# EAGLE design datalogger_micro (EAGLE 7.3.0)
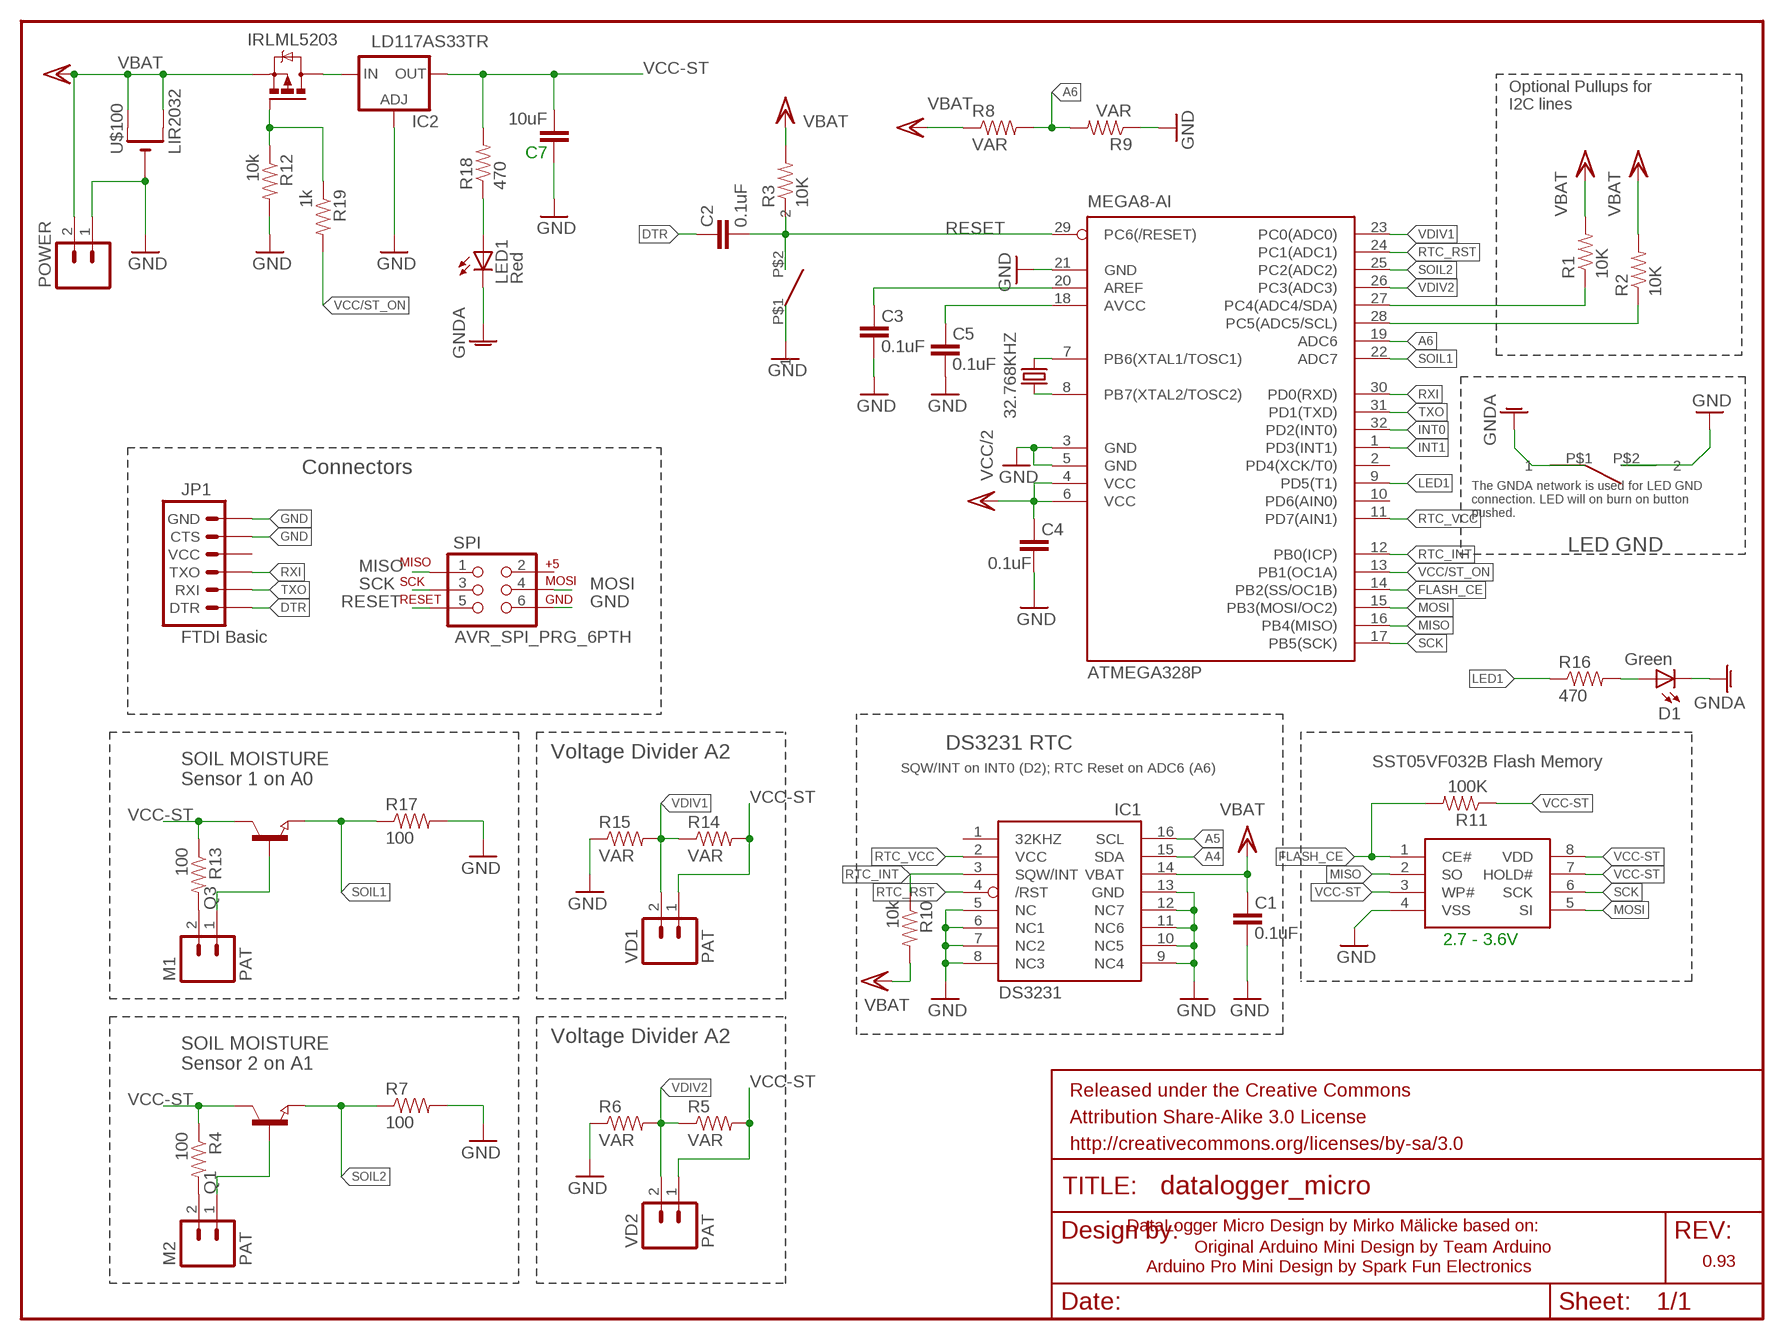
[diagram p0: schematic, sheet 1]

## Parts
32.768KHZ  CRYSTALTC38H  [TC38H]
ATMEGA328P  MEGA8-AI  [TQFP32-08]
C1  0.1uF  CAP0603-CAP  [0603-CAP]
C2  0.1uF  CAP0603-CAP  [0603-CAP]
C3  0.1uF  CAP0603-CAP  [0603-CAP]
C4  0.1uF  CAP0603-CAP  [0603-CAP]
C5  0.1uF  CAP0603-CAP  [0603-CAP]
C7  10uF  CAP1206  [1206]
D1  Green  LED  [0603-LED-ALT1]
FRAME1  FRAME-LETTER  [CREATIVE_COMMONS]
IC1  DS3231/SO  [SO16W]
IC2  LD117AS33TR  [SOT223]
JP1  FTDI Basic  ARDUINO_SERIAL_PROGRAMPTH  [1X06]
LED1  Red  LED  [0603-LED-ALT1]
M1  PAT  M02PTH  [1X02]
M2  PAT  M02PTH  [1X02]
POWER  M02PTH  [1X02]
Q1  NPN-TRANSISTOR_SOT23  [SOT23]
Q2  IRLML5203  [MICRO3]
Q3  NPN-TRANSISTOR_SOT23  [SOT23]
R1  10K  RESISTOR0603-RES  [0603-RES]
R2  10K  RESISTOR0603-RES  [0603-RES]
R3  10K  RESISTOR0603-RES  [0603-RES]
R4  100  RESISTOR0603-RES  [0603-RES]
R5  VAR  RESISTOR0603-RES  [0603-RES]
R6  VAR  RESISTOR0603-RES  [0603-RES]
R7  100  RESISTOR0603-RES  [0603-RES]
R8  VAR  RESISTOR0603-RES  [0603-RES]
R9  VAR  RESISTOR0603-RES  [0603-RES]
R10  10k  RESISTOR0603-RES  [0603-RES]
R11  100K  RESISTOR0603-RES  [0603-RES]
R12  10k  RESISTOR0603-RES  [0603-RES]
R13  100  RESISTOR0603-RES  [0603-RES]
R14  VAR  RESISTOR0603-RES  [0603-RES]
R15  VAR  RESISTOR0603-RES  [0603-RES]
R16  470  RESISTOR0603-RES  [0603-RES]
R17  100  RESISTOR0603-RES  [0603-RES]
R18  470  RESISTOR0603-RES  [0603-RES]
R19  1k  RESISTOR0603-RES  [0603-RES]
SPI  AVR_SPI_PRG_6PTH  [2X3]
U$1  DRUCKTASTER-1PIN  [DRUCKTASTER-1PIN]
U$2  DRUCKTASTER-1PIN  [DRUCKTASTER-1PIN]
U$3  SST25VF032B  [SO-08]
U$100  LIR2032  CR2032SMT  [CR2032-SMD]
VD1  PAT  M02PTH  [1X02]
VD2  PAT  M02PTH  [1X02]

## Nets
A4: ATMEGA328P.27(PC4(ADC4/SDA)) IC1.15(SDA) R1.1
A5: ATMEGA328P.28(PC5(ADC5/SCL)) IC1.16(SCL) R2.1
A6: ATMEGA328P.19(ADC6) R8.2 R9.2
DTR: C2.2 JP1.1(DTR)
FLASH_CE: ATMEGA328P.14(PB2(SS/OC1B)) R11.2 U$3.1(CE#)
GND [vcc]: ATMEGA328P.3(GND) ATMEGA328P.5(GND) ATMEGA328P.21(GND) C1.1 C3.1 C4.1 C5.1 C7.2 IC1.5(NC) IC1.6(NC1) IC1.7(NC2) IC1.8(NC3) IC1.9(NC4) IC1.10(NC5) IC1.11(NC6) IC1.12(NC7) IC1.13(GND) IC2.1(ADJ) JP1.5(CTS) JP1.6(GND) POWER.1 R6.1 R7.2 R9.1 R12.2 R15.1 R17.2 SPI.6 U$1.P$1 U$2.P$2 U$3.4(VSS) U$100.-
GNDA: D1.C LED1.C U$2.P$1
INT0: ATMEGA328P.32(PD2(INT0))
INT1: ATMEGA328P.1(PD3(INT1))
LED1: ATMEGA328P.9(PD5(T1)) R16.1
MISO: ATMEGA328P.16(PB4(MISO)) SPI.1 U$3.2(SO)
MOSI: ATMEGA328P.15(PB3(MOSI/OC2)) SPI.4 U$3.5(SI)
N$1: ATMEGA328P.20(AREF) C3.2
N$2: 32.768KHZ.1 ATMEGA328P.7(PB6(XTAL1/TOSC1))
N$3: 32.768KHZ.2 ATMEGA328P.8(PB7(XTAL2/TOSC2))
N$4: LED1.A R18.1
N$5: M2.1 Q1.1(B)
N$6: M1.1 Q3.1(B)
N$7: D1.A R16.2
N$8: M2.2 R4.2
N$9: M1.2 R13.2
N$10: IC2.3(IN) Q2.3(D)
N$11: Q2.1(G) R12.1 R19.1
RESET: ATMEGA328P.29(PC6(/RESET)) C2.1 R3.1 SPI.5 U$1.P$2
RTC_INT: ATMEGA328P.12(PB0(ICP)) IC1.3(SQW/INT) R10.1
RTC_RST: ATMEGA328P.24(PC1(ADC1)) IC1.4(/RST)
RTC_VCC: ATMEGA328P.11(PD7(AIN1)) IC1.2(VCC)
RXI: ATMEGA328P.30(PD0(RXD)) JP1.3(TXO)
SCK: ATMEGA328P.17(PB5(SCK)) SPI.3 U$3.6(SCK)
SOIL1: ATMEGA328P.22(ADC7) Q3.2(E) R17.1
SOIL2: ATMEGA328P.25(PC2(ADC2)) Q1.2(E) R7.1
TXO: ATMEGA328P.31(PD1(TXD)) JP1.2(RXI)
VBAT: ATMEGA328P.4(VCC) ATMEGA328P.6(VCC) ATMEGA328P.18(AVCC) C1.2 C4.2 C5.2 IC1.14(VBAT) POWER.2 Q2.2(S) R1.2 R2.2 R3.2 R8.1 R10.2 U$100.+$1(+) U$100.+$2(+1) ; supply symbol labelled VCC/2
VCC-ST: C7.1 IC2.2(OUT) Q1.3(C) Q3.3(C) R4.1 R5.2 R11.1 R13.1 R14.2 R18.2 U$3.3(WP#) U$3.7(HOLD#) U$3.8(VDD) VD1.1 VD2.1
VCC/ST_ON: ATMEGA328P.13(PB1(OC1A)) R19.2
VDIV1: ATMEGA328P.23(PC0(ADC0)) R14.1 R15.2 VD1.2
VDIV2: ATMEGA328P.26(PC3(ADC3)) R5.1 R6.2 VD2.2
Unconnected: ATMEGA328P.2(PD4(XCK/T0)) ATMEGA328P.10(PD6(AIN0)) IC1.1(32KHZ) JP1.4(VCC) SPI.2

## Notes on the sheet
- Optional Pullups for 
  I2C lines
- Connectors
- The GNDA network is used for LED GND 
  connection. LED will on burn on button
  pushed.
- LED GND
- DS3231 RTC
- Voltage Divider A2
- SST05VF032B Flash Memory
- SQW/INT on INT0 (D2); RTC Reset on ADC6 (A6)
- SOIL MOISTURE
  Sensor 1 on A0
- 2.7 - 3.6V
- Voltage Divider A2
- SOIL MOISTURE
  Sensor 2 on A1
- DataLogger Micro Design by Mirko Mälicke based on:
- Original Arduino Mini Design by Team Arduino
- 0.93
- Arduino Pro Mini Design by Spark Fun Electronics

## Library data of the parts
32.768KHZ = crystal:CRYSTAL: CRYSTAL; OC_FARNELL: unknown; OC_NEWARK: unknown
ATMEGA328P = atmel:MEGA8: MICROCONTROLLER 8 Kbytes FLASH, 1 kbytes SRAM, 512 bytes EEPROM, USART, 6-channel 10 bit ADC, 2-channel 8 bit ADC Pin compatible with Atmega48, ATMega88, ATMega168 Source: avr.lbr; MPN: ATMEGA8-16AU; OC_FARNELL: 9171371; OC_NEWARK: 73M8863
C1-C5 C7 = SparkFun:CAP: Capacitor Standard 0603 ceramic capacitor, and 0.1" leaded capacitor.
D1 LED1 = Testing:LED: LEDs Standard schematic elements and footprints for 5mm, 3mm, 1206, and 0603 sized LEDs. 5mm - Spark Fun Electronics SKU : COM-00529 (and others)
FRAME1 = SparkFun-Aesthetics:FRAME-LETTER: Schematic Frame Standard 8.5x11 US Letter frame
IC1 = adafruit:DS3231
IC2 = v-reg:LD117A?*: Low drop fixed and adjustable positive voltage regulators 1 A Source: http://www.st.com/stonline/products/literature/ds/7194/ld1117axx.pdf
JP1 = SparkFun:ARDUINO_SERIAL_PROGRAM
M1 M2 POWER VD1 VD2 = SparkFun:M02: Header 2 Standard 2-pin 0.1" header. Use with straight break away headers (SKU : PRT-00116), right angle break away headers (PRT-00553), swiss pins (PRT-00743), machine pins (PRT-00117), and female headers (PRT-00115). Molex polarized connector foot print use with SKU : PRT-08233 with associated crimp pins and housings.
Q1 Q3 = semicon-smd-ipc:NPN-TRANSISTOR_: NPN TRANSISTOR
Q2 = transistor-power:IRLML5203: HEXFET P-Channel Power MOSFET
R1-R19 = SparkFun:RESISTOR: Resistor Basic schematic elements and footprints for 0603, 1206, and PTH resistors.
SPI = SparkFun-Connectors:AVR_SPI_PRG_6: AVR ISP 6 Pin This is the reduced ISP connector for AVR programming. Common on Arduino. This footprint will take up less PCB space and can be used with a 10-pin to 6-pin adapter such as SKU: BOB-08508 **Special note about "TEST_POINT" package. The stop mask is on the top side, so if you want your programming test points to be on the bottom of your board, make sure to place this package on the bottom side of the board. This also ensure that the orientation to program from the bottom side will be correct.
U$1 U$2 = Edu Logger Basic Components:DRUCKTASTER-1PIN: Drucktaster (1x EIN) Einfacher schmaler Drucktaster als DIP Variante (1x 2pin) Dimension (B x L x H): 3.5mm x 6mm x 5mm Zu kaufen u.a. beim Omega, Freiburg
U$3 = SST25:SST25VF032B
U$100 = adafruit:CR2032

## Net classes
1 vcc: width 0.254 mm

## Board
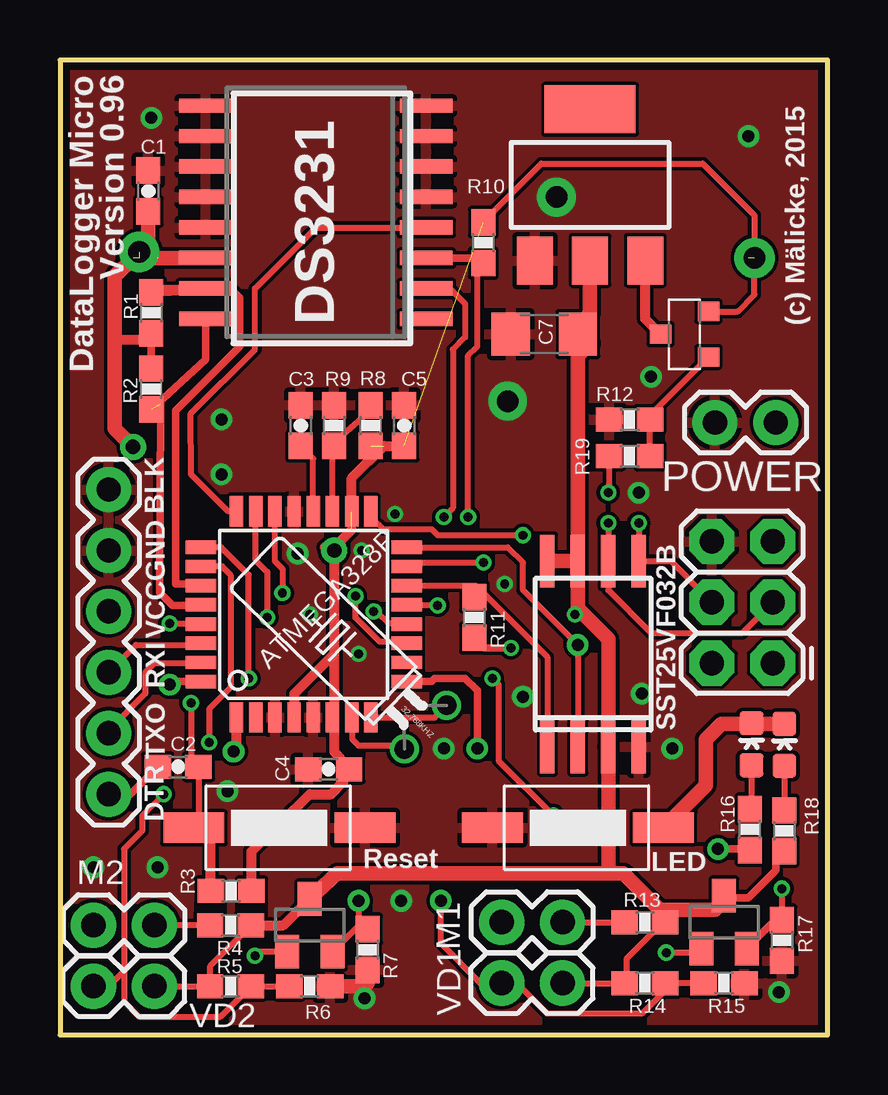
[diagram p1: board, top side]
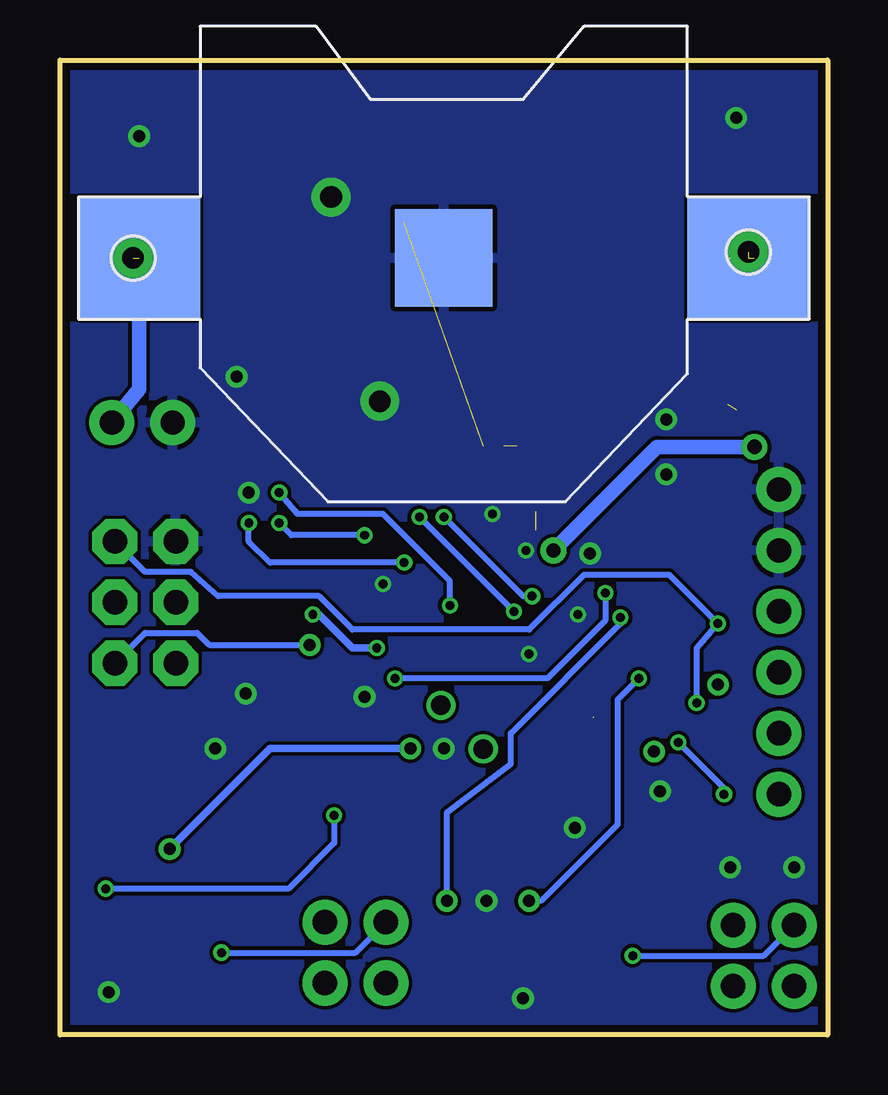
[diagram p2: board, bottom side, seen from below]

Size 32 x 40.64 mm. Coordinates in mm from the lower left corner, seen from the top.
Outline: 0,40.64 0,0 32,0 32,40.64 0,40.64
Copper layers (1*16): Top 0.035mm / dielectric 1.5mm / Bottom 0.035mm
Design rules "PCB-POOL Standard *": minimum track width 0.15mm, minimum drill 0.2mm, track to track 0.15mm, track to pad 0.15mm, pad to pad 0.15mm, via to via 0.15mm, smd to smd 0.15mm, copper to edge 0.3mm, drill to drill 0.2mm, minimum pad ring 0.2mm, minimum via ring 0.15mm, stop-mask expansion 0.075mm, vias tented up to drill 0mil, thermal gap 0.2mm

### Footprints (pad centres in the part's own frame; a part is rotated, then mirrored left to right if it is on the bottom)
TC38H = drill 0.813: 1 -1.27,0; 2 1.27,0
TQFP32-08 = smd 1.27 x 0.559: 1 -4.293,2.8; 2 -4.293,2; 3 -4.293,1.2; 4 -4.293,0.4; 5 -4.293,-0.4; 6 -4.293,-1.2; 7 -4.293,-2; 8 -4.293,-2.8; 17 4.293,-2.8; 18 4.293,-2; 19 4.293,-1.2; 20 4.293,-0.4; 21 4.293,0.4; 22 4.293,1.2; 23 4.293,2; 24 4.293,2.8 | smd 0.559 x 1.27: 9 -2.8,-4.293; 10 -2,-4.293; 11 -1.2,-4.293; 12 -0.4,-4.293; 13 0.4,-4.293; 14 1.2,-4.293; 15 2,-4.293; 16 2.8,-4.293; 25 2.8,4.293; 26 2,4.293; 27 1.2,4.293; 28 0.4,4.293; 29 -0.4,4.293; 30 -1.2,4.293; 31 -2,4.293; 32 -2.8,4.293
0603-CAP = smd 1.1 x 1: 1 -0.85,0; 2 0.85,0
1206 = smd 1.6 x 1.8: 1 -1.4,0; 2 1.4,0
0603-LED-ALT1 = smd 1 x 1: A 0,-0.877; C 0,0.877
SO16W = smd 0.6 x 2.2: 1 -4.445,-4.6; 2 -3.175,-4.6; 3 -1.905,-4.6; 4 -0.635,-4.6; 5 0.635,-4.6; 6 1.905,-4.6; 7 3.175,-4.6; 8 4.445,-4.6; 9 4.445,4.6; 10 3.175,4.6; 11 1.905,4.6; 12 0.635,4.6; 13 -0.635,4.6; 14 -1.905,4.6; 15 -3.175,4.6; 16 -4.445,4.6
SOT223 = smd 1.5 x 2: 1 -2.3,-3.15; 2 0,-3.15; 3 2.3,-3.15 | smd 3.8 x 2: 4 0,3.15
1X06 = drill 1.016 pad 1.88: 1 0,0; 2 2.54,0; 3 5.08,0; 4 7.62,0; 5 10.16,0; 6 12.7,0
1X02 = drill 1.016 pad 1.88: 1 0,0; 2 2.54,0
SOT23 = smd 1 x 1.4: 1 -0.95,-1.1; 2 0.95,-1.1; 3 0,1.1
MICRO3 = smd 0.8 x 0.9: 1 -0.95,-1; 2 0.95,-1; 3 0,1
0603-RES = smd 1.1 x 1: 1 -0.85,0; 2 0.85,0
2X3 = drill 1.016 pad 1.88 octagon: 1 0,0; 2 0,2.54; 3 2.54,0; 4 2.54,2.54; 5 5.08,0; 6 5.08,2.54
DRUCKTASTER-1PIN = smd 2.54 x 1.27: P$1 -3.575,0; P$2 3.56,0
SO-08 = smd 0.6 x 2.2: 1 -1.905,-3.87; 2 -0.635,-3.87; 3 0.635,-3.87; 4 1.905,-3.87; 5 1.905,3.87; 6 0.635,3.87; 7 -0.635,3.87; 8 -1.905,3.87
CR2032-SMD = smd 5.08 x 5.08: +$1 -12.7,0; +$2 12.7,0 | smd 4.064 x 4.064: - 0,0

### Placement (x,y rotation side)
32.768KHZ  15.24,12.83 46 top
ATMEGA328P  10.16,17.53 90 top
C1  3.68,35.18 270 top
C2  4.93,11.18 180 top
C3  10.03,25.4 270 top
C4  11.2,11.07 0 top
C5  14.35,25.4 270 top
C7  20.19,29.21 180 top
D1  28.83,12.12 0 top
FRAME1  -20.94,-10.79 0 top  (outside the outline)
IC1  10.67,34.29 90 top
IC2  22.1,35.43 0 top
JP1  2.03,10.03 90 top
LED1  30.2,12.09 0 top
M1  18.41,4.7 0 top
M2  1.4,4.57 0 top
POWER  27.31,25.53 0 top
Q1  10.41,4.57 0 top
Q2  26.04,29.21 90 top
Q3  27.69,4.7 0 top
R1  3.81,30.1 270 top
R2  3.81,26.92 90 top
R3  7.14,5.99 0 top
R4  7.11,4.57 180 top
R5  7.11,2.03 180 top
R6  10.41,2.03 180 top
R7  12.83,3.56 270 top
R8  12.95,25.4 90 top
R9  11.43,25.4 270 top
R10  17.65,33.02 90 top
R11  17.27,17.4 90 top
R12  23.75,25.65 180 top
R13  24.38,4.7 180 top
R14  24.38,2.16 180 top
R15  27.69,2.16 180 top
R16  28.76,8.56 90 top
R17  30.1,3.94 270 top
R18  30.2,8.51 270 top
R19  23.75,24.13 180 top
SPI  29.72,15.49 90 top
U$1  9.14,8.64 180 top
U$2  21.59,8.64 180 top
U$3  22.23,15.88 0 top
U$100  16,32.38 0 bottom
VD1  20.96,2.16 180 top
VD2  3.94,2.03 180 top

### Tracks (layer width: path | path; a pad name or v marks a point on that pad's centre or on a via)
A4
  Top 0.305: IC1.15 4.18,31.12 R1.1 7.2,31.02 7.49,30.73 7.49,28.7 4.83,26.04 4.83,18.8 5.8,18.8 ATMEGA328P.27
A5  (1 unrouted)
  Top 0.305: 4.19,26.29 4.17,18.44 4.7,17.91 5.85,17.91 ATMEGA328P.28 | IC1.16 6.07,28.15 R2.1
A6
  Top 0.254: ATMEGA328P.19 11.36,24.42 R9.2 11.76,24.42 11.81,24.47 11.81,25.02 12.95,26.04 R8.2
DTR
  Top 0.305: JP1.1 2.92,10.03 C2.2
FLASH_CE
  Top 0.254: ATMEGA328P.14 17.34,18.73 17.59,18.48 | 17.59,18.48 20.32,15.75 U$3.1 | R11.2 17.53,18.41 17.59,18.48
GND  (via drill 0.37 pad 0.25, 0.5 pad 0.25, 0.9 pad 0.25)
  Top 0.254: 10.54,13.25 ATMEGA328P.5
  Top 0.61: R6.1 12.7,2.03 12.83,2.16 R7.2
  other vias: 24.64,27.43 1.4,6.99 19.3,14.1 18.67,26.42 3.81,38.23 6.99,10.16 14.22,5.59 4.06,6.99 10.54,8.64 25.53,11.94 16,11.94 12.7,1.52 29.97,1.78 28.7,37.46 24.13,22.61 9.91,20.07 24.26,14.22 20.7,34.92 18.54,18.8 10.41,17.53 12.45,15.88 12.57,20.19 13.97,21.72 6.73,23.37 6.73,25.65
  pour Bottom: -0.38,41.78 33.02,41.78 33.02,-1.14 -0.38,-1.02
  pour Top: -0.38,-1.02 33.02,-1.14 33.02,41.78 -0.38,41.78
GNDA
  Top 0.61: D1.C LED1.C 27.57,12.97 26.92,12.32 26.92,10.4 U$2.P$1
INT0  (via drill 0.5)
  Top 0.305: v4.57,14.61 4.95,14.73 5.75,14.73 ATMEGA328P.32
INT1  (via drill 0.5)
  Top 0.406: v7.24,11.81 7.36,11.93 ATMEGA328P.1
LED1  (via drill 0.5)
  Top 0.305: ATMEGA328P.9 15.49,14.73 15.62,14.86 16.89,14.86 17.4,14.35 v17.4,11.94 | v27.43,7.75 28.73,7.75 R16.1
  Bottom 0.305: v17.4,11.94 23.24,11.94 v27.43,7.75
MISO  (via drill 0.5)
  Top 0.254: ATMEGA328P.16 18.66,20.33 19.3,19.68 19.3,18.54 21.4,16.45 v21.59,16.26 U$3.2
  Bottom 0.254: SPI.1 28.45,16.76 26.29,16.76 25.78,16.26 v21.59,16.26
MOSI  (via drill 0.37)
  Top 0.254: ATMEGA328P.15 14.95,19.53 15.11,19.68 v17.65,19.68 | v24.13,21.34 U$3.5 25.47,19.74 SPI.4
  Bottom 0.254: v17.65,19.68 23.24,19.68 24.13,20.57 v24.13,21.34
N$1
  Top 0.254: ATMEGA328P.20 10.56,24.02 C3.2
N$2
  Top 0.254: ATMEGA328P.7 12.16,12.73 12.19,12.7 12.19,12.32 12.45,12.07 14.33,12.07 32.768KHZ.1
N$3
  Top 0.254: ATMEGA328P.8 15.62,13.23 32.768KHZ.2
N$4
  Top 0.254: LED1.A 30.2,9.49 R18.1
N$5  (via drill 0.37)
  Top 0.254: Q1.1 8.3,3.47 v8.13,3.3
  Bottom 0.254: v8.13,3.3 2.67,3.3 M2.1
N$6  (via drill 0.37)
  Top 0.254: Q3.1 26.54,3.43 v25.27,3.43
  Bottom 0.254: v25.27,3.43 19.69,3.43 M1.1
N$7
  Top 0.254: D1.A 28.83,9.85 R16.2
N$8
  Top 0.254: R4.2 M2.2
N$9
  Top 0.254: M1.2 R13.2
N$10
  Top 0.406: Q2.3 24.4,29.85 IC2.3
  Top 0.61: 24.77,32.54 IC2.3
N$11
  Top 0.254: R19.1 R12.1 24.6,25.82 Q2.1
RESET  (via drill 0.37)
  Top 0.254: v4.57,17.14 5.5,17.14 ATMEGA328P.29 | 5.84,8.51 5.08,8.51 U$1.P$2 5.78,8.83 C2.1 5.71,11.56 5.46,11.56 v5.46,13.84
  Top 0.406: R3.1 6.29,8.06 U$1.P$2
  Bottom 0.254: v5.46,13.84 5.46,16.13 v4.57,17.14 6.6,19.18 10.16,19.18 12.45,16.89 19.81,16.89 21.21,18.29 25.4,18.29 26.54,19.3 28.45,19.3 SPI.5
RTC_INT  (via drill 0.37)
  Top 0.254: ATMEGA328P.12 14.43,17.14 13.72,17.14 13.21,17.65 v13.08,17.65 | v17.02,21.59 17.02,28.32 17.4,28.7 17.4,31.88 17.65,32.13 R10.1
  Top 0.305: IC1.3 17.57,32.38 R10.1
  Bottom 0.254: v13.08,17.65 v17.02,21.59
RTC_RST
  Top 0.254: ATMEGA328P.24 7.01,21.82 5.46,23.37 5.45,25.9 8.13,28.57 8.13,31.12 10.67,33.66 IC1.4
RTC_VCC  (via drill 0.37)
  Top 0.254: ATMEGA328P.11 14.4,16.38 13.34,16.38 12.32,17.4 v12.32,18.29 | IC1.2 16.26,31.12 16.89,30.48 16.89,29.08 16.38,28.57 16.38,21.97 v16,21.59
  Bottom 0.254: v12.32,18.29 12.7,18.29 v16,21.59
RXI
  Top 0.254: JP1.3 3.17,16.26 5.8,16.26
  Top 0.305: 5.8,16.26 ATMEGA328P.30
SCK  (via drill 0.37)
  Top 0.254: ATMEGA328P.17 13.06,21.56 13.06,21.49 13.46,21.08 15.49,21.08 15.75,20.83 v19.3,20.83 | v22.86,21.34 U$3.6 22.86,18.54 24.64,16.76 28.45,16.76 SPI.3
  Bottom 0.254: v19.3,20.83 22.35,20.83 v22.86,21.34
SOIL1  (via drill 0.37)
  Top 0.254: v18.03,14.86 18.29,14.61 18.29,11.43 v20.57,9.14 | v30.1,6.1 R17.1 | v9.27,18.41 9.27,19.43 8.96,19.74 ATMEGA328P.22
  Top 0.305: Q3.2 29.82,4.79 R17.1
  Bottom 0.254: v9.27,18.41 9.27,17.27 11.68,14.86 v18.03,14.86 | v20.57,9.14 20.57,8 22.48,6.1 v30.1,6.1
SOIL2  (via drill 0.37, 0.5)
  Top 0.254: v12.45,5.59 12.45,4.55 | v7.87,14.86 7.87,19.18 6.73,20.33 ATMEGA328P.25 | Q1.2 12.45,4.55 | 12.45,4.55 12.83,4.55 R7.1
  Bottom 0.254: v7.87,14.86 8.76,13.97 8.76,8.76 11.94,5.59 v12.45,5.59
TXO
  Top 0.254: 5.83,15.49 3.94,15.49 3.56,15.11 3.56,14.22 2.03,12.7 JP1.2
  Top 0.305: 5.83,15.49 ATMEGA328P.31
VBAT  (via drill 0.6, 0.9 pad 1.68)  (8 unrouted)
  Top 0.254: 17.65,33.91 20.07,36.32 26.8,36.32 28.96,34.16 v28.96,32.38 28.96,30.86 28.25,30.16 Q2.2
  Top 0.305: R2.2 R1.2
  Top 0.406: 11.3,13.18 ATMEGA328P.6 | 12.16,21.05 11.43,20.32 | 11.43,20.32 v11.43,20.19 11.43,15.88 | 11.43,15.88 11.43,13.3 ATMEGA328P.6 | 9.78,13.21 9.78,14.22 11.43,15.88 | ATMEGA328P.6 11.43,12.91 11.43,11.81 C4.2 11.81,10.54 11.3,10.03 10.41,10.03 7.99,7.65 R3.2 | R1.2 3.72,28.96 2.29,28.96 | 11.05,20.32 11.43,20.32 | ATMEGA328P.18 12.16,23.21 13.5,24.55 C5.2
  Top 0.61: IC1.14 4.1,32.38 | 4.02,32.38 3.05,32.38 2.29,31.62 2.29,28.96 2.29,25.27 v3.05,24.51 | R10.2 17.65,33.91 | C1.2 3.68,32.64 v3.3,32.64
  Bottom 0.61: POWER.2 28.7,26.92 U$100.+$1 | v11.43,20.19 7.11,24.51 v3.05,24.51
VCC-ST  (via drill 0.37)
  Top 0.254: VD2.1 R5.2 6.26,2.87 R4.1 | R13.1 24.89,4.44 23.62,3.17 23.62,2.25 R14.2 VD1.1
  Top 0.305: Q3.3 27.81,5.71 28.7,5.71 29.85,6.86 29.85,7.24 30.23,7.37 R18.2 | v18.8,16.13 17.69,16.13 R11.1 | v21.46,17.53 21.59,17.65 21.59,17.78
  Top 0.406: R4.1 9.31,4.57 Q1.3
  Top 0.61: 22.86,6.73 U$3.3 22.86,16.51 21.59,17.78 U$3.7 | Q1.3 11.56,6.73 22.86,6.73 | 22.86,6.73 23.5,6.73 25.02,5.21 | 25.02,5.21 27.31,5.21 27.69,5.59 Q3.3 | 25.02,5.21 25.23,4.95 R13.1 | IC2.2 22.09,30.13 C7.1 22.1,28.83 21.59,28.32 U$3.7 | U$3.7 U$3.8
  Bottom 0.305: v18.8,16.13 19.81,16.13 21.21,17.53 v21.46,17.53
VCC/ST_ON  (via drill 0.37)
  Top 0.254: v15.75,17.91 14.47,17.91 ATMEGA328P.13 | v22.86,22.61 22.9,22.61 R19.2
  Bottom 0.254: v15.75,17.91 15.75,18.92 18.54,21.72 22.1,21.72 v22.86,22.61
VDIV1  (via drill 0.37, 0.5)
  Top 0.254: R15.2 R14.1 25.23,1.87 24.26,0.89 20.32,0.89 19.05,2.16 VD1.2 17.53,2.16 15.88,3.81 v15.88,5.59 | v8.64,17.4 8.64,19.3 8.16,19.78 ATMEGA328P.23
  Bottom 0.254: v8.64,17.4 8.64,17.14 13.21,12.57 13.21,11.3 15.88,9.27 v15.88,5.59
VDIV2  (via drill 0.37)
  Top 0.254: v4.32,10.03 3.43,9.14 3.43,8.51 2.67,7.75 2.67,2.67 | v6.22,12.19 6.22,13.59 7.11,14.48 7.11,19.18 6.76,19.53 ATMEGA328P.26 | R6.2 R5.1 6.69,0.76 3.3,0.76 2.67,1.4 2.67,2.67 | VD2.2 2.03,2.03 2.67,2.67
  Bottom 0.254: v6.22,12.19 4.32,10.29 v4.32,10.03

### Text on the board
tPlace: DataLogger Micro | Version 0.96 | (c) Mälicke, 2015 | DS3231 | BLK | GND | VCC | RXI | TXO | SST25VF032B | DTR | Reset | LED
tValues: Valid combinations: | 168V / 3.3V Reg / 8MHz | 168 / 5V Reg / 16MHz | 168 / 5V Reg / 20MHz | Mark back accordingly | Arduino Pro Mini
tDocu: Design by Mirko Mälicke, based on: / Original Arduino Mini Design by Team Arduino / Arduino Pro Mini Design by SparkFun Electronics / Revised by Pete Lewis